# Altium project BootlegCarThing.PrjPcb
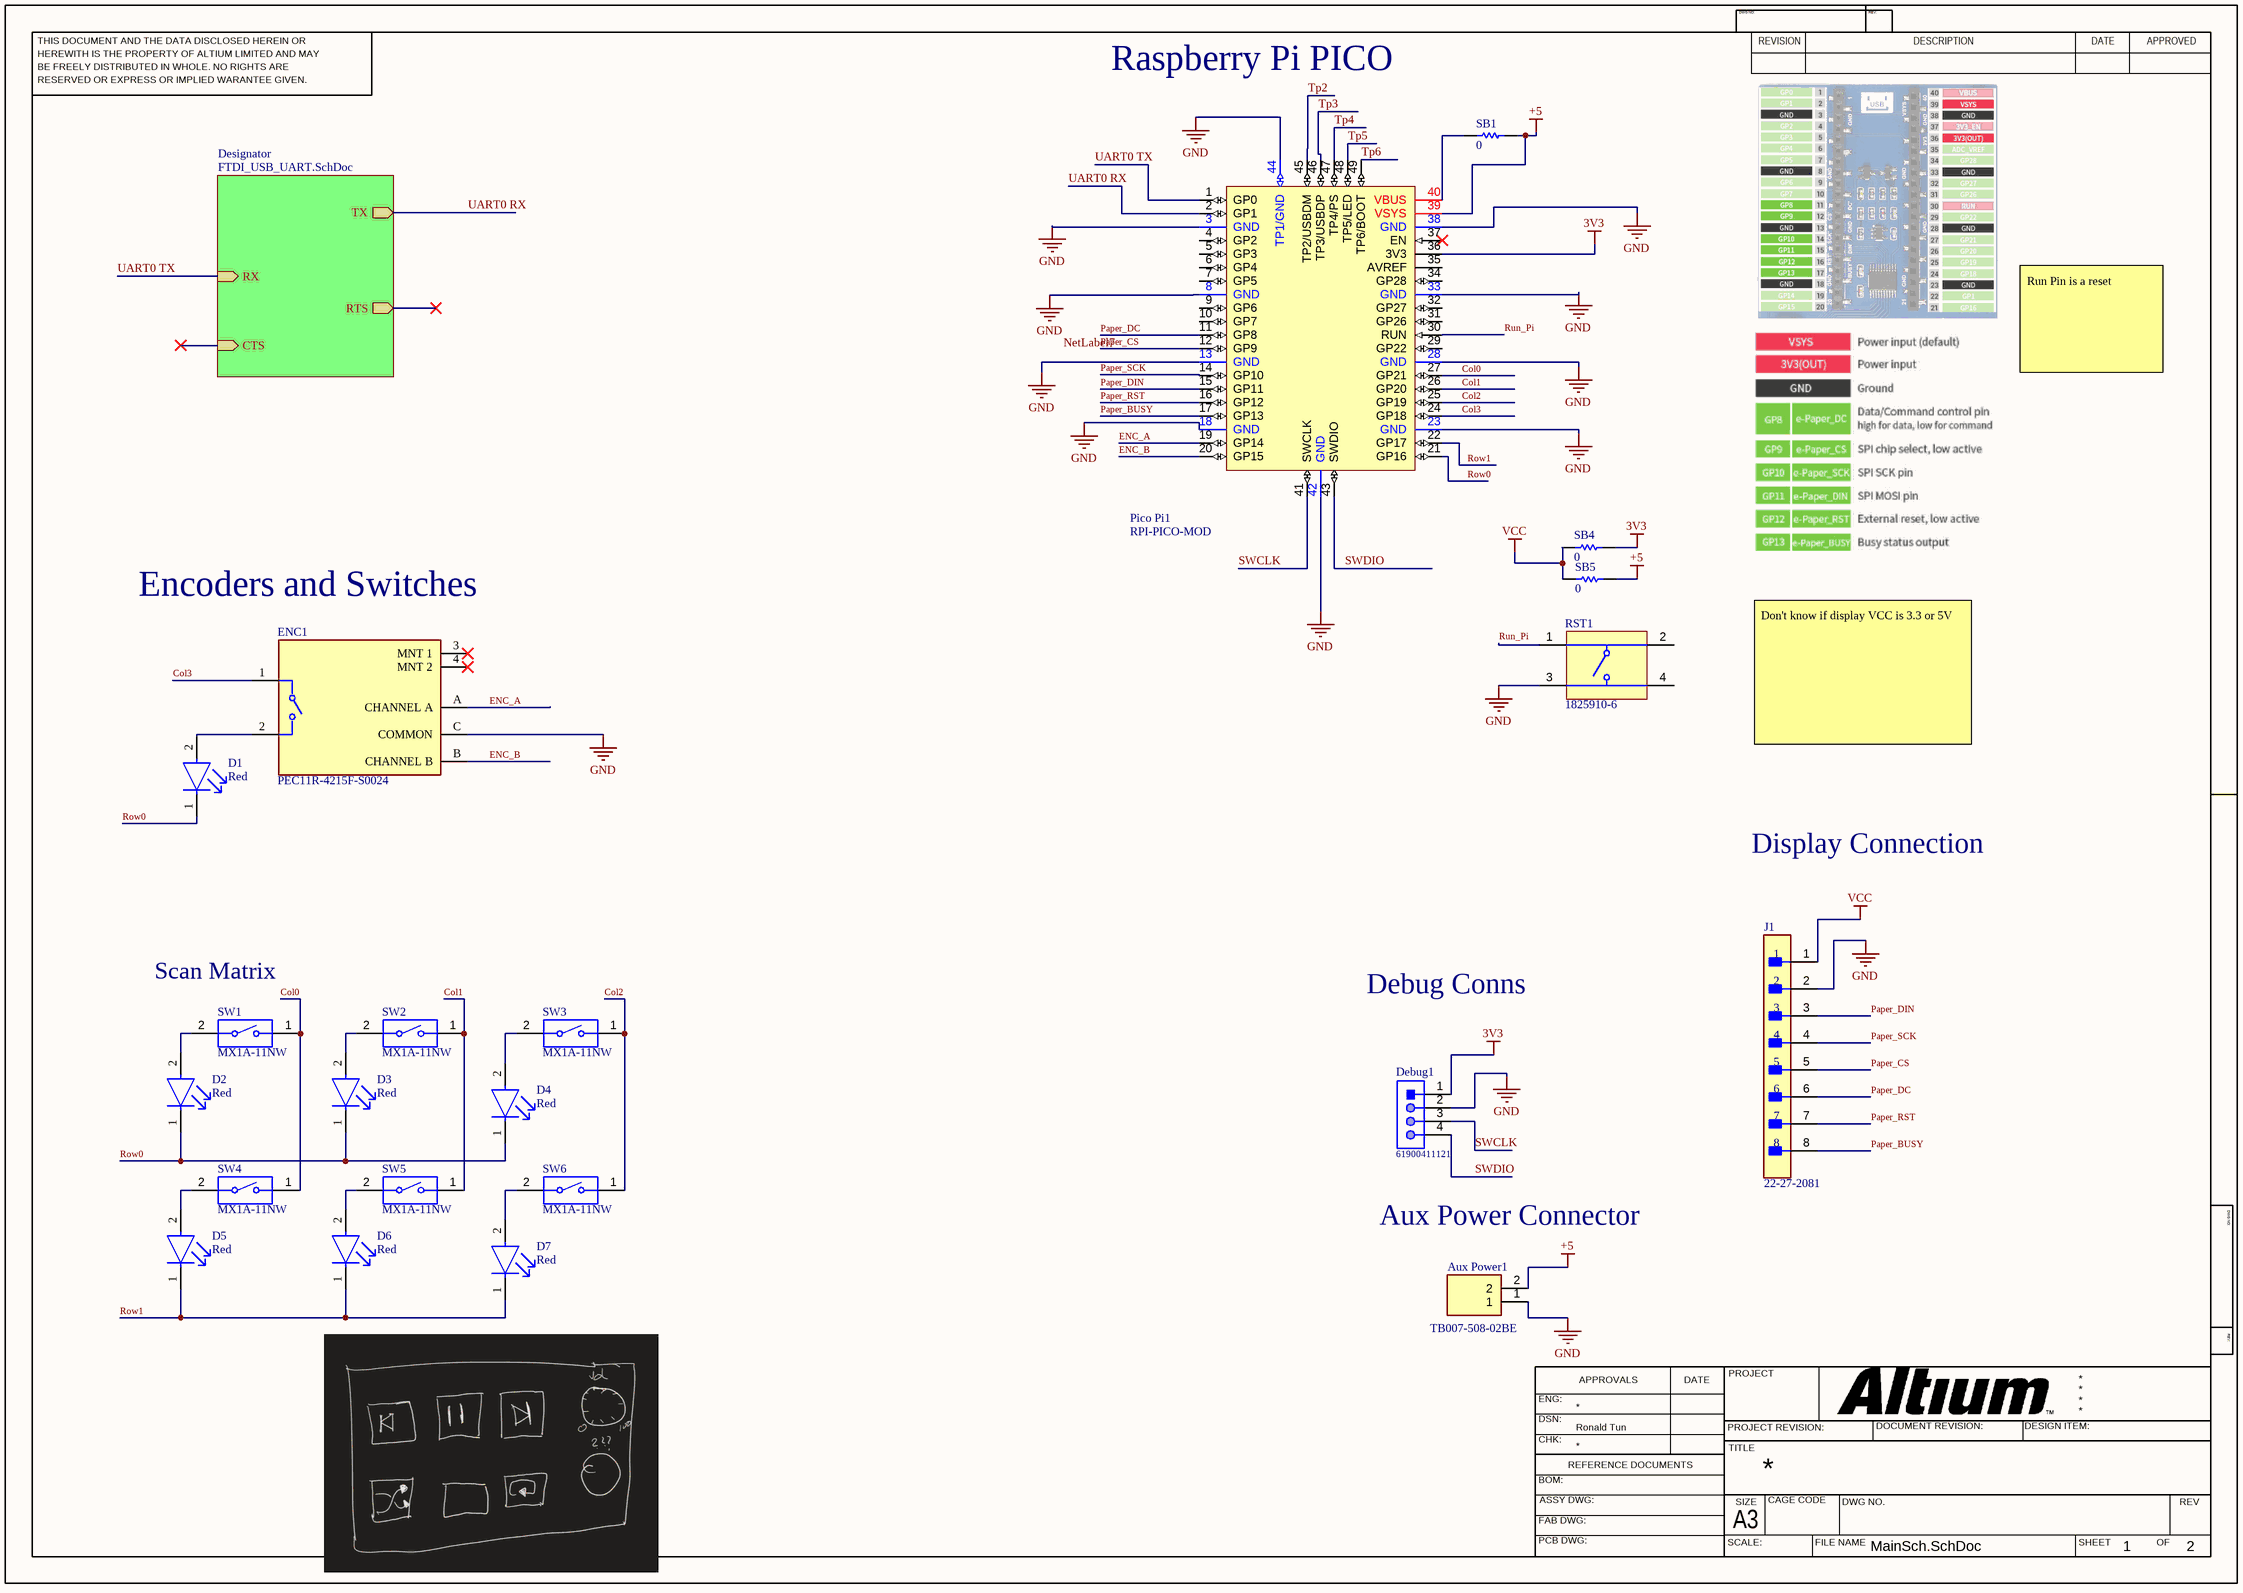
[diagram p0: MainSch.SchDoc]
2 sheets, 39 parts. Net scope: hierarchical (ports join the sheet entries above them; power ports are global).
Board file: SP_Bootleg.PcbDoc
Sheets:
  MainSch.SchDoc
    Designator = FTDI_USB_UART.SchDoc

## Sheet MainSch.SchDoc
size 420 x 297 mm; Author: Ronald Tun; DrawnBy: Ronald Tun; Revision: 1; SheetNumber: 1; SheetTotal: 2

### Parts
Aux_Power1  TB007-508-02BE  [TB00750802BE]
D1  Red  [FP-150080SS75000-MFG]
D2  Red  [FP-150080SS75000-MFG]
D3  Red  [FP-150080SS75000-MFG]
D4  Red  [FP-150080SS75000-MFG]
D5  Red  [FP-150080SS75000-MFG]
D6  Red  [FP-150080SS75000-MFG]
D7  Red  [FP-150080SS75000-MFG]
Debug1  61900411121  [61900411121]
ENC1  PEC11R-4215F-S0024  [FP-PEC11R-4215F-S0024-MFG]
J1  22-27-2081  [FP-22-27-2081-MFG]
Pico_Pi1  RPI-PICO-MOD  [RPI-PICO-MOD]
RST1  1825910-6  [TECO-1825910-6_V]
SB1  0  [RESC1608X55X25ML10T15]
SB4  0  [RESC1608X55X25ML10T15]
SB5  0  [RESC1608X55X25ML10T15]
SW1  MX1A-11NW  [CHRY-MX1A-11NW_V]
SW2  MX1A-11NW  [CHRY-MX1A-11NW_V]
SW3  MX1A-11NW  [CHRY-MX1A-11NW_V]
SW4  MX1A-11NW  [CHRY-MX1A-11NW_V]
SW5  MX1A-11NW  [CHRY-MX1A-11NW_V]
SW6  MX1A-11NW  [CHRY-MX1A-11NW_V]

### Sub-sheets
Designator = FTDI_USB_UART.SchDoc: TX (out), RX (in), CTS (in), RTS (out)

### Nets
3V3: Debug1.1 Pico_Pi1.36(3V3) SB4.1
+5: Aux_Power1.2 Pico_Pi1.39(VSYS) SB1.1 SB5.1
GND: Aux_Power1.1 Debug1.2 ENC1.C(COMMON) J1.2 Pico_Pi1.3(GND) Pico_Pi1.8(GND) Pico_Pi1.13(GND) Pico_Pi1.18(GND) Pico_Pi1.23(GND) Pico_Pi1.28(GND) Pico_Pi1.33(GND) Pico_Pi1.38(GND) Pico_Pi1.42(GND) Pico_Pi1.44(TP1/GND) RST1.3
VCC: J1.1 SB4.2 SB5.2
Col0: Pico_Pi1.27(GP21) SW1.1 SW4.1
Col1: Pico_Pi1.26(GP20) SW2.1 SW5.1
Col2: Pico_Pi1.25(GP19) SW3.1 SW6.1
Col3: ENC1.1 Pico_Pi1.24(GP18)
ENC_A: ENC1.A(CHANNEL_A) Pico_Pi1.19(GP14)
ENC_B: ENC1.B(CHANNEL_B) Pico_Pi1.20(GP15)
Paper_BUSY: J1.8 Pico_Pi1.17(GP13)
Paper_CS: J1.5 Pico_Pi1.12(GP9)
Paper_DC: J1.6 Pico_Pi1.11(GP8)
Paper_DIN: J1.3 Pico_Pi1.15(GP11)
Paper_RST: J1.7 Pico_Pi1.16(GP12)
Paper_SCK: J1.4 Pico_Pi1.14(GP10)
Row0: D1.1(C) D2.1(C) D3.1(C) D4.1(C) Pico_Pi1.21(GP16)
Row1: D5.1(C) D6.1(C) D7.1(C) Pico_Pi1.22(GP17)
Run_Pi: Pico_Pi1.30(RUN) RST1.1
SWCLK: Debug1.3 Pico_Pi1.41(SWCLK)
SWDIO: Debug1.4 Pico_Pi1.43(SWDIO)
Tp2: Pico_Pi1.45(TP2/USBDM)
Tp3: Pico_Pi1.46(TP3/USBDP)
Tp4: Pico_Pi1.47(TP4/PS)
Tp5: Pico_Pi1.48(TP5/LED)
Tp6: Pico_Pi1.49(TP6/BOOT)
UART0 RX: Pico_Pi1.2(GP1) ; sheet Designator/TX
UART0 TX: Pico_Pi1.1(GP0) ; sheet Designator/RX
NetD1_2: D1.2(A) ENC1.2
NetD2_2: D2.2(A) SW1.2
NetD3_2: D3.2(A) SW2.2
NetD4_2: D4.2(A) SW3.2
NetD5_2: D5.2(A) SW4.2
NetD6_2: D6.2(A) SW5.2
NetD7_2: D7.2(A) SW6.2
NetPico_Pi1_40: Pico_Pi1.40(VBUS) SB1.2

Not connected (* = marked no-connect by the designer): ENC1 3(MNT_1)* 4(MNT_2)*; Pico_Pi1 4(GP2) 5(GP3) 6(GP4) 7(GP5) 9(GP6) 10(GP7) 29(GP22) 31(GP26) 32(GP27) 34(GP28) 35(AVREF) 37(EN)*; RST1 2 4

### Notes on the sheet
- Raspberry Pi PICO
- Run Pin is a reset
- (near ENC1) Encoders and Switches
- Don't know if display VCC is 3.3 or 5V
- Display Connection
- (near SW1) Scan Matrix
- Debug Conns
- Aux Power Connector
- Labels drawn without touching a wire or pin: NetLabel7
- THIS DOCUMENT AND THE DATA DISCLOSED HEREIN OR
- HEREWITH IS THE PROPERTY OF ALTIUM LIMITED AND MAY
- DWG NO:
- REVISION
- REV:
- DESCRIPTION
- DATE
- APPROVED
- BE FREELY DISTRIBUTED IN WHOLE. NO RIGHTS ARE
- RESERVED OR EXPRESS OR IMPLIED WARANTEE GIVEN.
- ENG:
- APPROVALS
- PROJECT
- DSN:
- CHK:
- REFERENCE DOCUMENTS
- PROJECT REVISION:
- TITLE
- DOCUMENT REVISION:
- DESIGN ITEM:
- BOM:
- FAB DWG:
- PCB DWG:
- ASSY DWG:
- SCALE:
- A3
- SIZE
- CAGE CODE
- FILE NAME
- DWG NO.
- SHEET
- OF
- REV

### Library data of the parts
Aux_Power1 = TB007-508-02BE: Connector; Manufacturer_Name: CUI Inc.; Datasheet Link: https://datasheet.datasheetarchive.com/originals/distributors/Datasheets_SAMA/67395fd1cd6fc86e483d0d8269f76301.pdf; Height: 14mm; Manufacturer_Part_Number: TB007-508-02BE; Mouser Part Number: 490-TB007-508-02BE; Mouser Price/Stock: https://www.mouser.co.uk/ProductDetail/CUI-Devices/TB007-508-02BE?qs=vLWxofP3U2y6PFKAfCqKUQ%3D%3D; Arrow Part Number: TB007-508-02BE; Arrow Price/Stock: https://www.arrow.com/en/products/tb007-508-02be/cui-devices?region=nac
D1-D7 = CMP-1426-00010-2: LED RED CLEAR 0805 SMD; Forward Voltage: 1.9V; Luminous Intensity: 60mcd; Dominant Wavelength: 630nm; Forward Current: 30mA; Viewing Angle: 140°; Lens Color: Colorless; Test Current: 20mA; Lens Size: 1.25mm; Packaging: Cut Tape; Width: 1.25mm; Case Code (Metric): 2012; Max Operating Temperature: 85°C; RoHS Compliant: Yes; Mount: Surface Mount; Case/Package: 0805; Series: WL-SMCW; Length: 2mm; Case Code (Imperial): 0805; Wavelength: 630nm; Lens Style: Clear; Min Operating Temperature: -40°C; Color: Red; Lens Transparency: Clear; Package Quantity: 1; Height: 0.8mm
Debug1 = CMP-1502-00586-1: Male Locking Header WR-WTB, THT, Vertical, pitch 2.54 mm, 1 x 4 position; Manufacturer: Wurth Elektronik; Working Voltage: 250VAC; Pitch: 2.54mm; Contact Resistance: 20mOhm; Position: 1x4; Publisher: WurthElektronik; Manufacturer URL: http://www.we-online.de; Datasheet URL: https://katalog.we-online.de/em/datasheet/6190xx11121.pdf; Operating Temperature: -40to105degC; Packaging: Bag; Gender: Male; Package Reference: 61900411121; Orientation: Vertical; Mounting Technology: THT; Part Number: 61900411121
ENC1 = CMP-1747-00012-2: ROTARY ENCODER MECHANICAL 24PPR; Hole Diameter: 1.8mm; Output Type: Quadrature; Pulses per Revolution: 24; Number of Channels: 2; Built in Switch: Yes; Min Operating Temperature: -30°C; Series: PEC11R; Type: Mechanical; Package Quantity: 150; Length: 21.5mm; Max Operating Temperature: 70°C; Encoder Type: Mechanical; Height: 13.4mm; Detent: Yes; Packaging: Bulk; Orientation: Vertical; Width: 12.5mm; Termination: PC Pins; Mount: Through Hole; REACH SVHC: No SVHC; Radiation Hardening: No; RoHS Compliant: Yes
J1 = CMP-04776-000265-1: CONN HEADER VERT 8POS 2.54MM; Voltage Rating (AC): 250V; Contact Resistance: 10mR; Number of Circuits: 8; Gender: Male; Current Rating: 4A; Insulation Resistance: 50GR; Hole Diameter: 1.02mm; Glow Wire Compliant: Non-compliant; Series: KK® 6410; Color: Natural; Material: Nylon; Lead Pitch: 2.54mm; Fastening Type: Friction; Voltage Rating: 250V; Pitch: 2.54mm; Max Operating Temperature: 75°C; Number of Poles: 8; Packaging: Bulk; Housing Color: White; RoHS Compliant: Yes; Halogen Free: Low Halogen; Number of Positions: 8; Package Quantity: 8000; Termination: Solder; Number of Contacts: 8; Number of Rows: 1; Housing Material: Nylon; Depth: 5.8mm; Contact Mating Length: 0.295inch; Orientation: Straight; Working Voltage: 250V; Contact Material: Brass; Contact Type: Male Pin; Voltage Rating (DC): 250V; Lead Free: Lead Free; Radiation Hardening: No; Mount: Through Hole; Min Operating Temperature: 0°C; Contact Plating: Tin; Flammability Rating: UL94 V-0
Pico_Pi1 = RPI-PICO-MOD: RASPBERRY PI PICO RP2040 BOARD; Manufacturer: Raspberry Pi Foundation; Manufacturer Part No: SC0915; Mounting Technology: SMT; Supplier: DigiKey; Supplier Part No: 2648-SC0915CT-ND; Supplier Link: https://www.digikey.com/en/products/detail/raspberry-pi/SC0915/13684020
RST1 = CMP-1684-00021-1: Tact Switch, SPST-NO, 0.05 A, -35 to 85 degC, 4-Pin THD, RoHS, Bulk; Manufacturer: TE Connectivity; Maximum Contact Resistance: 100mOhm; Mechanical Life: 100000Cycles; Bushing Type: Unthreaded; Switch Configuration: OFF(ON); Maximum DC Voltage Rating: 24V; Contact Rating @ Voltage: 0.05A@24VDC; Actuator Color: Black; Body Orientation: Straight; Function: MomentaryContact; Illumination: N/R; Actuator Style: RoundButton; Actuator Material: PolybutyleneTerephthalate; Dielectric Strength: 500VAC; Pole Throw Configuration: SPST; Actuator Length: 1.4mm; Product Weight: N/A; Contact Material: CopperAlloy; Housing Material: N/A; Terminal Type: PCPins; Minimum Insulation Resistance: 100MOhm; Package Description: 4-Pin Through Hole Device, Body 5.99 x 5.99 mm, Pitch 6.5 mm; Part No: 1825910-6; Package Reference: THD; Base Material: N/A; Manufacturer URL: http://www.te.com; Contact Plating: Silver; RoHS: Yes; Datasheet Version: Rev. C9; Electrical Life: 100000Cycles; Maximum AC Voltage Rating: N/A; Thread Size: N/R; Operating Temperature: -35to85C; Mounting: ThroughHole; Dimension: 5.99x5mm; Datasheet URL: http://www.te.com/commerce/DocumentDelivery/DDEController?Action=showdoc&DocId=Customer+Drawing%7F1825910%7FC9%7Fpdf%7FEnglish%7FENG_CD_1825910_C9.pdf%7F1825910-6; Family: 1825910; Seal Location: N/A; Seal Description: N/A; Packaging: N/A
SB1 SB4 SB5 = CMP-2100-03667-1: Chip Resistor, 0 Ohm, +/- 5%, 0.1 W, -55 to 155 degC, 0603 (1608 Metric), RoHS, Tape and Reel; Manufacturer: Yageo; Temperature Coefficient: 200ppm/degreesC; Voltage Rating: 50V; Power Rating: 100mW; Resistance: 0mOhm; Width: 0.8mm; Max Operating Temperature: 155degC; Tolerance: 5%; Package Reference: 0603; Height: 0.45mm; Depth: 0.8mm; Package Description: 2-Pin Surface Mount Device, Body 1.6 x 0.8 mm; Termination: SMD/SMT; Package Quantity: 5000; Case/Package: 0603; Case Code (Imperial): 0603; Radiation Hardening: No; Number of Pins: 2; Length: 1.6mm; Lead Free: LeadFree; Voltage Rating (DC): 50V; Military Standard: Not; Datasheet URL: http://www.yageo.com/NewPortal/yageodocoutput?fileName=/pdf/R-Chip/PYu-RC_Group_51_RoHS_L_5.pdf; Manufacturer URL: http://www.yageo.com/; Packaging: TapeandReel; Case Code (Metric): 1608; Min Operating Temperature: -55degC; Composition: ThickFilm; RoHSCompliant: true; Contact Plating: Tin; Datasheet Version: Rev. 5, 10/2016; REACH SVHC: NoSVHC
SW1-SW6 = CMP-2000-06786-1: Keylock Switch, 12 V, -10 to 70 degC, 2-Pin THD, RoHS, Bulk; Manufacturer: Cherry; Part No: MX1A11NW; Maximum DC Voltage Rating: 12V; COO: UK; Row Spacing: 6.35mm; Pole Throw Configuration: SPST; Total Travel: 4.06mm; Illumination Type: N/R; Actuator Style: Button; Operating Force: 0.58N; Electrical Life: 50000000Cycle; Minimum Insulation Resistance: 100MOhm; Body Orientation: Straight; Actuator Length: 3.6mm; Switch Configuration: N.O.; Maximum Current Rating: 0.01A; Maximum Contact Resistance: 200mOhm; Actuator Color: N/A; Terminal Type: PCPins; Operating Temperature: -10to70C; Number of Terminals: 2; Operating Speed: N/A; Maximum AC Voltage Rating: 12V; Housing Material: N/A; Datasheet URL: https://cdn.sparkfun.com/datasheets/Components/Switches/MX%20Series.pdf; Type: DesktopProfile; Terminal Pitch: 2.54mm; Package Reference: MX1A-11NW; ECCN: EAR99; Family: MX; Packaging: N/A; HTS: 8536509065; Actuator Material: N/A; Package Description: 2-Pin Through Hole Device, Body 15.6 x 15.6 mm; Dielectric Strength: N/A; Illumination Color: N/R; Manufacturer URL: http://cherryswitches.com/cn/; Dimension: 15.6x15.6x15.2mm; Mechanical Life: N/A; RoHS: Unknown; Contact Plating: N/A; Supplier: CherryElectrical; Contact Material: Silver/Gold; IP Rating: N/A; Mounting: ThroughHole; Datasheet Version: 09/2000; Maximum Power Rating: N/A; Mounting Technology: ThroughHole

## Sheet FTDI_USB_UART.SchDoc
size A3; SheetNumber: 2; SheetTotal: 2
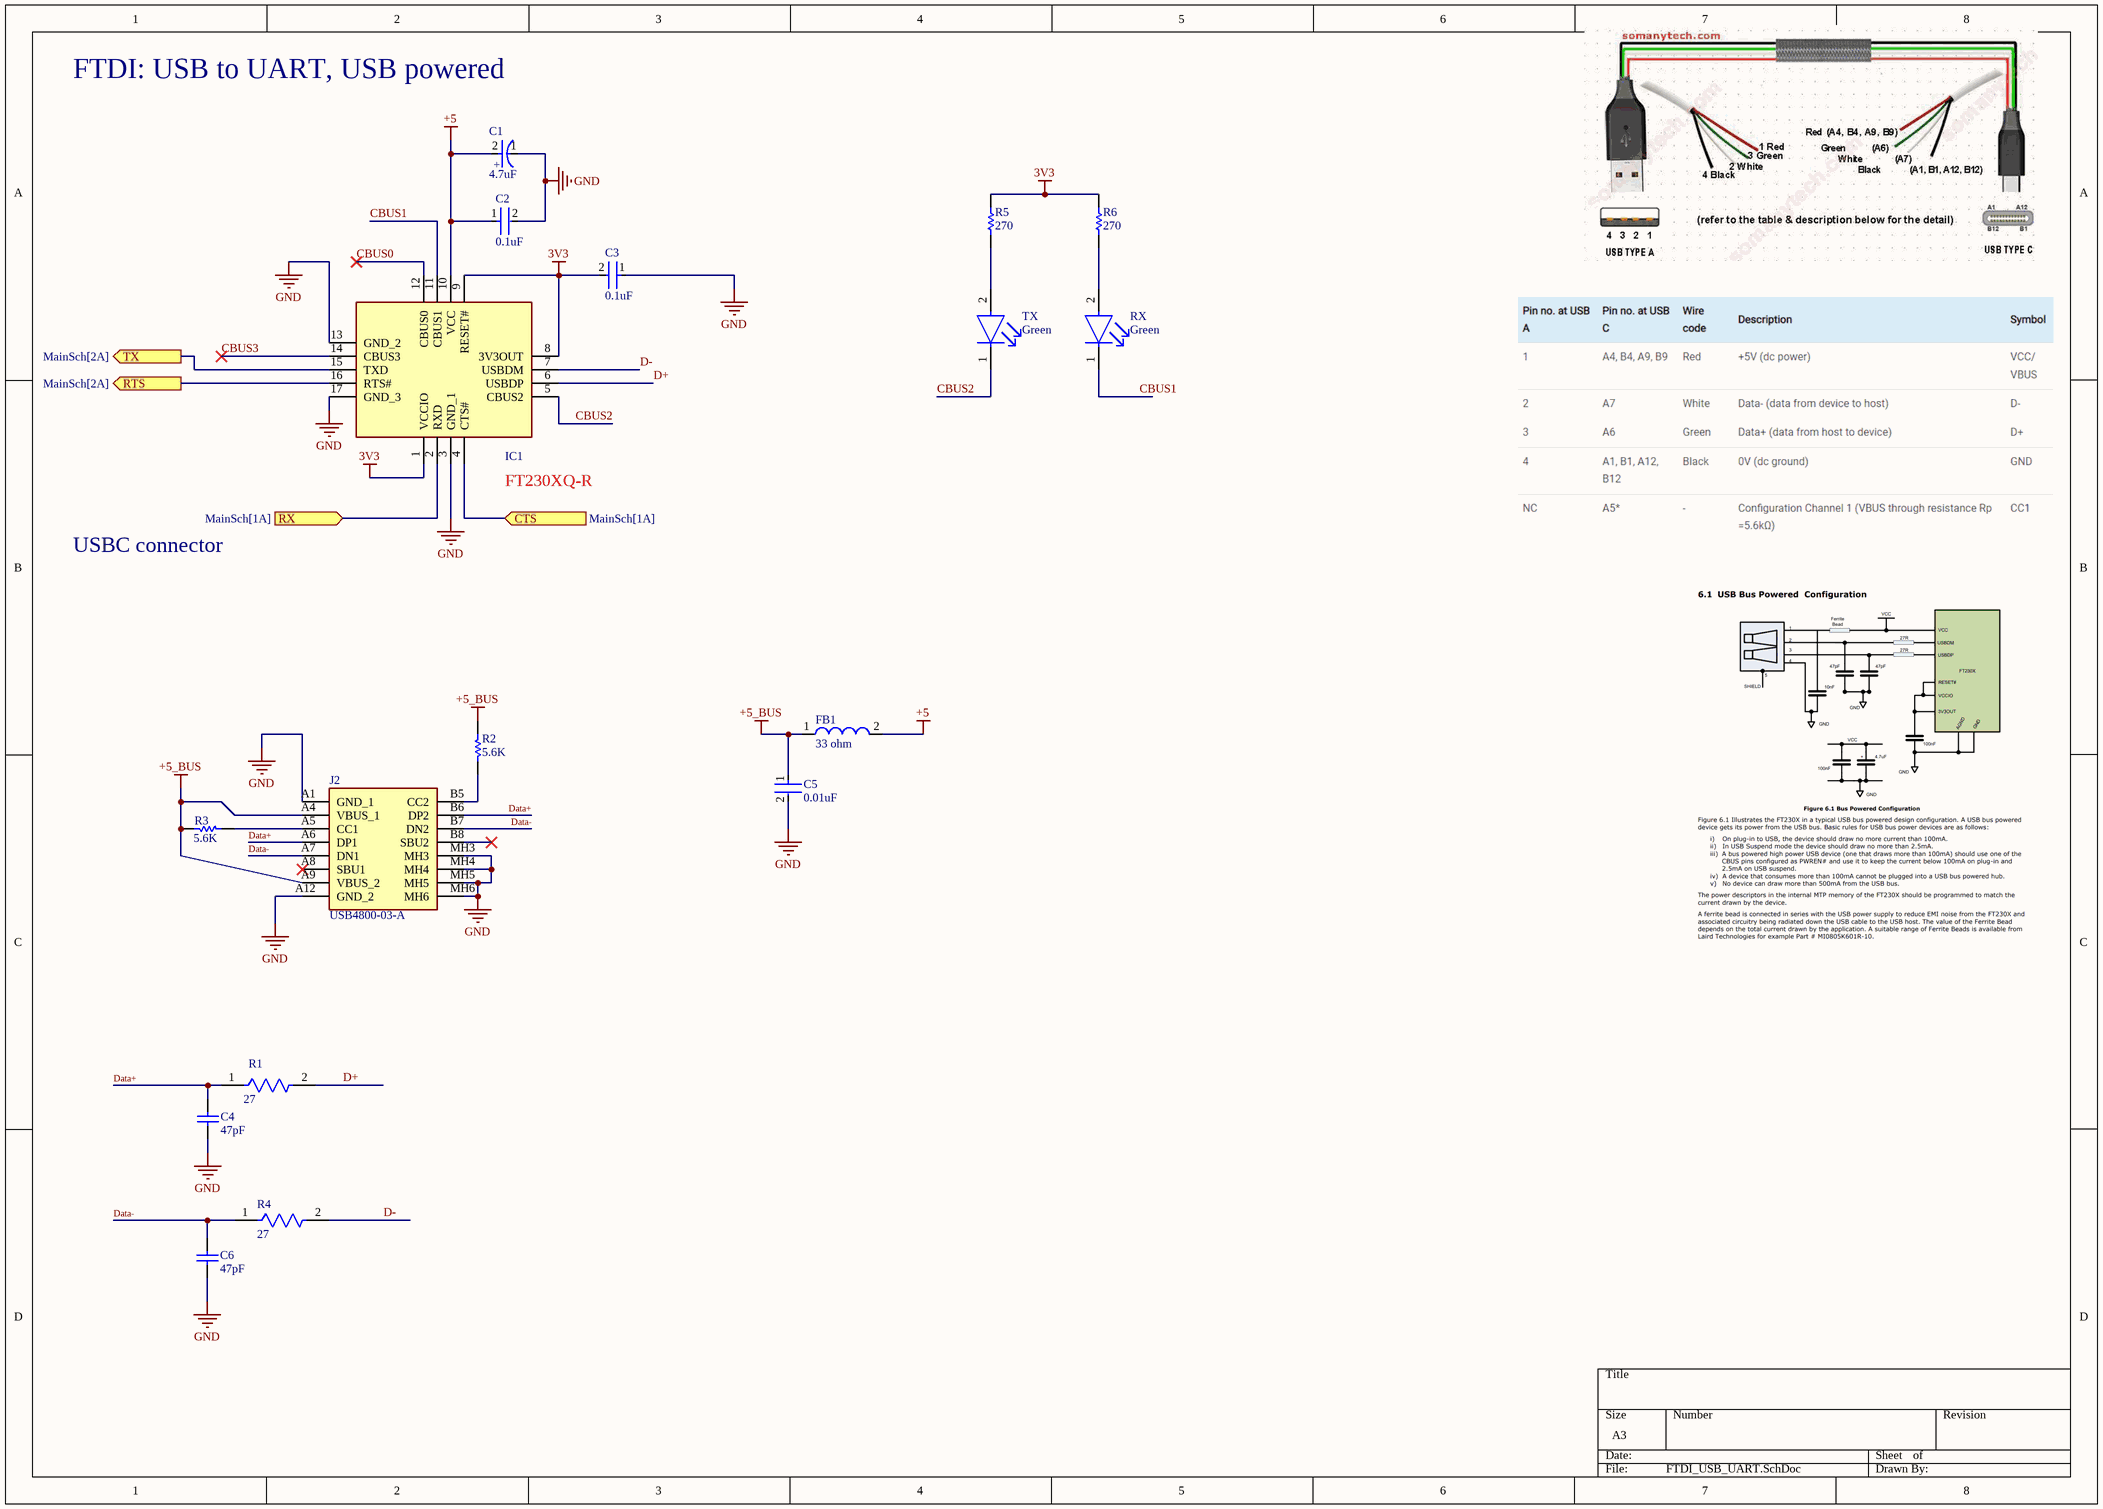
[diagram p1: FTDI_USB_UART.SchDoc]

### Parts
C1  4.7uF  [FP-RAD-TH-D_6_3_0_5-L_11-MFG]
C2  0.1uF  [FP-C0603C-CF-MFG]
C3  0.1uF  [FP-C0603C-CF-MFG]
C4  47pF  [CAPC1608X90X35NL10T15]
C5  0.01uF  [FP-CC0603-DA-MFG]
C6  47pF  [CAPC1608X90X35NL10T15]
FB1  33 ohm  [SMD-0805]
IC1  FT230XQ-R  [QFN65P400X400X80-17N]
J2  USB4800-03-A  [USB480003A]
R1  27  [FP-ERJ3EK-IPC_B]
R2  5.6K  [RESC1609X50X30NL10T20]
R3  5.6K  [RESC1609X50X30NL10T20]
R4  27  [FP-ERJ3EK-IPC_B]
R5  270  [RESC1609X50X30NL10T20]
R6  270  [RESC1609X50X30NL10T20]
RX  Green  [FP-150080SS75000-MFG]
TX  Green  [FP-150080SS75000-MFG]

### Ports
CTS (in, see MainSch[1A]), RTS (out, see MainSch[2A]), RX (in, see MainSch[1A]), TX (out, see MainSch[2A])

### Nets
3V3: C3.2 IC1.1(VCCIO) IC1.8(3V3OUT) IC1.9(RESET#) R5.2 R6.2
+5: C1.2(A) C2.1 FB1.2 IC1.10(VCC)
+5_BUS: C5.1 FB1.1 J2.A4(VBUS_1) J2.A9(VBUS_2) R2.1 R3.2
GND: C1.1(C) C2.2 C3.1 C4.1 C5.2 C6.1 IC1.3(GND_1) IC1.13(GND_2) IC1.17(GND_3) J2.A1(GND_1) J2.A12(GND_2) J2.MH3 J2.MH4 J2.MH5 J2.MH6
CBUS0: IC1.12(CBUS0)
CBUS1: IC1.11(CBUS1) RX.1(C)
CBUS2: IC1.5(CBUS2) TX.1(C)
CBUS3: IC1.14(CBUS3)
D+: IC1.6(USBDP) R1.2
D-: IC1.7(USBDM) R4.2
Data+: C4.2 J2.A6(DP1) J2.B6(DP2) R1.1
Data-: C6.2 J2.A7(DN1) J2.B7(DN2) R4.1
UART0 RX: IC1.15(TXD) ; port TX
UART0 TX: IC1.2(RXD) ; port RX
NetIC1_4: IC1.4(CTS#) ; port CTS
NetIC1_16: IC1.16(RTS#) ; port RTS
NetJ2_A5: J2.A5(CC1) R3.1
NetJ2_B5: J2.B5(CC2) R2.2
NetR5_1: R5.1 TX.2(A)
NetR6_1: R6.1 RX.2(A)

Not connected (* = marked no-connect by the designer): J2 A8(SBU1)* B8(SBU2)*

### Notes on the sheet
- FTDI: USB to UART, USB powered
- USBC connector
- (in symbol CMP-05427-000237-1) +

### Library data of the parts
C1 = CMP-05427-000237-1: Aluminum Electrolytic Capacitors (Radial Lead Type) 4.7uF ±20% 160V; Life (Hours): 2000Hour; Ripple Current: 43mA; Dielectric Material: Aluminium; Lead/Base Style: Straight; Lead Diameter: 0.5mm; Dissipation Factor: 0.15%; Height - Seated (Max): 0.48inch; Voltage: 160V; REACH SVHC: No SVHC; Package Quantity: 200; Length: 11.2mm; Termination: Radial; Weight: 0.01lb; Construction: RADIAL; Voltage Rating (DC): 160V; Number of Pins: 2; Voltage Rating: 160V; Min Operating Temperature: -25°C; Packaging: Bulk; Radiation Hardening: No; Series: NHG; Max Operating Temperature: 105°C; Height: 11.2mm; Mount: Through Hole; Tolerance: 20%; Capacitance: 4.7uF; Width: 0.25inch; Lead Pitch: 2.5mm; Diameter: 6.3mm; Ripple Current (AC): 43mA; Case/Package: Radial; Lead Free: Lead Free; RoHS Compliant: Yes
C2 C3 = CMP-2006-03061-2: CAP CER 0.1UF 50V X7R 0603; Manufacturer: KEMET; Manufacturer Part Number: C0603C104K5RACTU; Tolerance: 0.1; Temperature Coefficient: 30ppm/°C; Material: Ceramic; Automotive Grade: Grade 1; Value: 0.10 μF; Temperature: -55°C to +125°C; RoHS: TRUE; Temperature Range High: +125°C; Lead Free: Yes; Octopart: https://octopart.com/c0603c104k5ractu-kemet-139244; Digikey Description: CAP CER 0.1UF 50V X7R 0603; Category: Cap; Package: C0603C-CF; ComponentLink2Description: Datasheet; Temperature Range Low: -55°C; Device Class L1: Passive Components; Voltage Rating: 50 V; Automotive: Yes; Device Class L3: Ceramic Capacitors; ComponentLink2URL: https://api.kemet.com/component-edge/download/datasheet/C0603C100J5GACAUTO.pdf; Capacitance: 0.10 μF; Device Class L2: Capacitors; Temperature Characteristic: X7R; Height: 0.87mm
C4 C6 = CMP-2006-02672-1: Manufacturer: Murata; Part Number: GRM1885C1H470JA01D
C5 = CMP-2100-03600-2: CAP CER 10000PF 50V X7R 0603; Manufacturer Part Number: CC0603KRX7R9BB103; Manufacturer: YAGEO; Tolerance: 0.1; Material: Ceramic; Temperature Coefficient: 15%; Value: 10 nF; Mouser Description: Multilayer Ceramic Capacitor, CC Series, 0.01 - F, - 10%, X7R, 50 V, 0603 [1608 Metric]; Digikey Description: CAP CER 10000PF 50V X7R 0603; Height: 0.9mm; Category: Cap; Temperature Characteristic: X7R; Footprint Url: http://www.yageo.com/exep/pages/download/literatures/UPY-C_GEN_24.pdf; Lead Free: Yes; Voltage Rating: 50 V; Temperature: -55°C to +125°C; Device Class L3: Ceramic Capacitors; ComponentLink2Description: Datasheet; Voltage: 50 V; Package: CC0603-DA; Octopart: https://octopart.com/cc0603krx7r9bb103-yageo-192938; Automotive: No; Temperature Range High: +125°C; Temperature Range Low: -55°C; RoHS: TRUE; Device Class L1: Passive Components; ComponentLink2URL: http://www.yageo.com/documents/recent/UPY-GPHC_X7R_6.3V-to-50V_18.pdf; Device Class L2: Capacitors; Capacitance: 10 nF
FB1 = CMP-0220-00044-1: SMD EMI Suppression Ferrite Bead WE-CBF, Z = 33 Ohm; PackageVersion: 2005; ComponentLink1URL: http://www.we-online.com; ComponentLink1Description: Manufacturer Link; ComponentLink2Description: Datasheet; PackageDescription: Chip Inductor, 2-Leads, Body 2.0 x 1.2 mm; ComponentLink2URL: http://www.we-online.de/katalog/media/pdf/742792012.pdf; Impedance: 33 Ohm; PackageReference: SMD-0805; DatasheetVersion: Dec-2005
IC1 = FT230XQ-R: Integrated Circuit; Manufacturer_Name: FTDI Chip; Datasheet Link: https://componentsearchengine.com/Datasheets/1/FT230XQ-R.pdf; Height: 0.8mm; Manufacturer_Part_Number: FT230XQ-R; Mouser Part Number: 895-FT230XQ-R; Mouser Price/Stock: https://www.mouser.co.uk/ProductDetail/FTDI/FT230XQ-R?qs=Gp1Yz1mis3VvmXwyDmIHOg%3D%3D
J2 = USB4800-03-A: Connector; Manufacturer_Name: GCT (GLOBAL CONNECTOR TECHNOLOGY); Datasheet Link: https://gct.co/connector/usb4800; Height: 5.58mm; Manufacturer_Part_Number: USB4800-03-A; Mouser Part Number: 640-USB4800-03-A; Mouser Price/Stock: https://www.mouser.co.uk/ProductDetail/GCT/USB4800-03-A?qs=vvQtp7zwQdMkfG8vViEZoQ%3D%3D
R1 R4 = CMP-2000-00396-2: RES SMD 27 OHM 1% 1/10W 0603; Max Power Dissipation: 100mW; Resistance: 27R; Voltage Rating: 75V; Temperature Coefficient: 100ppm/°C; Number of Pins: 2; Case Code (Imperial): 0603; Resistance Tolerance: 1%; Max Operating Temperature: 155°C; Min Operating Temperature: -55°C; Termination: SMD/SMT; Length: 1.6mm; Resistor Type: Thick Film; Tolerance: 1%; Packaging: Tape and Reel; Radiation Hardening: No; Series: ERJ; Depth: 0.8mm; RoHS Compliant: Yes; Lead Free: Lead Free; Height: 0.022inch; Width: 0.031inch; Mount: Surface Mount; Contact Plating: Tin; Number of Terminations: 2; Features: Automotive AEC-Q200; Military Standard: Not; Power Rating: 100mW; Package Quantity: 1; Case/Package: 0603; Construction: Rectangular; Voltage Rating (DC): 75V; Case Code (Metric): 1608
R2 R3 R5 R6 = CMP-1012-00708-2: Part Number: CRCW060356K0FKEA; Manufacturer: Vishay Dale
RX TX = CMP-1426-00010-2: as D1 on sheet MainSch; Packaging: Cut Tape; Width: 1.25mm; Case Code (Metric): 2012; Max Operating Temperature: 85°C; RoHS Compliant: Yes; Mount: Surface Mount; Case/Package: 0805; Series: WL-SMCW; Length: 2mm; Case Code (Imperial): 0805; Wavelength: 630nm; Lens Style: Clear; Min Operating Temperature: -40°C; Color: Red; Lens Transparency: Clear; Package Quantity: 1; Height: 0.8mm

## Nets that join several sheets
3V3: MainSch (Debug1.1 Pico_Pi1.36 SB4.1), FTDI_USB_UART (6 pins)
+5: MainSch (Aux_Power1.2 Pico_Pi1.39 SB1.1 SB5.1), FTDI_USB_UART (C1.2 C2.1 FB1.2 IC1.10)
GND: MainSch (15 pins), FTDI_USB_UART (15 pins)
UART0 RX: MainSch (Pico_Pi1.2), FTDI_USB_UART (IC1.15)
UART0 TX: MainSch (Pico_Pi1.1), FTDI_USB_UART (IC1.2)